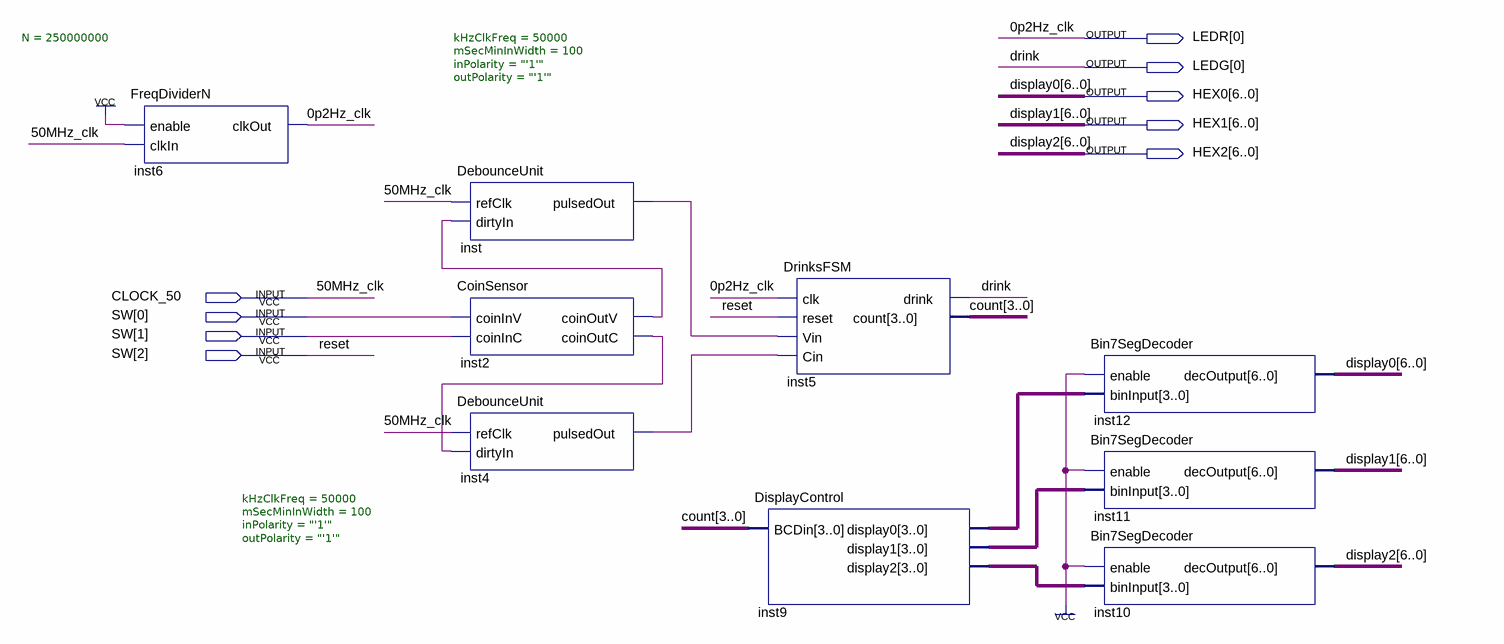
[diagram p0: schematic sheet]
// Quartus schematic DrinksMachineV2.bdf as structural Verilog: 9 symbols, 9 pins
module DrinksMachineV2 (
  input  CLOCK_50,
  input  [2:0] SW,
  output [0:0] LEDR,
  output [0:0] LEDG,
  output [6:0] HEX0,
  output [6:0] HEX1,
  output [6:0] HEX2
);

  wire inst2_coinoutc, inst2_coinoutv, inst4_pulsedout, inst_pulsedout;
  wire [3:0] count, inst9_display0, inst9_display1, inst9_display2;

  FreqDividerN #(.N(250000000)) inst6 (.enable(1'b1), .clkIn(CLOCK_50), .clkOut(LEDR[0]));
  DebounceUnit #(.kHzClkFreq(50000), .mSecMinInWidth(100), .inPolarity("'1'"), .outPolarity("'1'")) inst (
    .refClk(CLOCK_50), .dirtyIn(inst2_coinoutv), .pulsedOut(inst_pulsedout));
  CoinSensor inst2 (.coinInV(SW[0]), .coinInC(SW[1]), .coinOutV(inst2_coinoutv), .coinOutC(inst2_coinoutc));
  DebounceUnit #(.kHzClkFreq(50000), .mSecMinInWidth(100), .inPolarity("'1'"), .outPolarity("'1'")) inst4 (
    .refClk(CLOCK_50), .dirtyIn(inst2_coinoutc), .pulsedOut(inst4_pulsedout));
  DisplayControl inst9 (.BCDin(count), .display0(inst9_display0), .display1(inst9_display1), .display2(inst9_display2));
  DrinksFSM inst5 (
    .clk(LEDR[0]), .reset(SW[2]), .Vin(inst_pulsedout), .Cin(inst4_pulsedout), .drink(LEDG[0]), .count(count));
  Bin7SegDecoder inst12 (.enable(1'b1), .binInput(inst9_display0), .decOutput(HEX0));
  Bin7SegDecoder inst11 (.enable(1'b1), .binInput(inst9_display1), .decOutput(HEX1));
  Bin7SegDecoder inst10 (.enable(1'b1), .binInput(inst9_display2), .decOutput(HEX2));

  // Other names for the same wires on the sheet: 0p2Hz_clk = LEDR[0]; 50MHz_clk = CLOCK_50; display0[6:0] = HEX0;
  //   display1[6:0] = HEX1; display2[6:0] = HEX2; drink = LEDG[0]; reset = SW[2]
endmodule
